# Altium schematic sheet Balancers.SchDoc
size A4; SheetNumber: 2; SheetTotal: 6
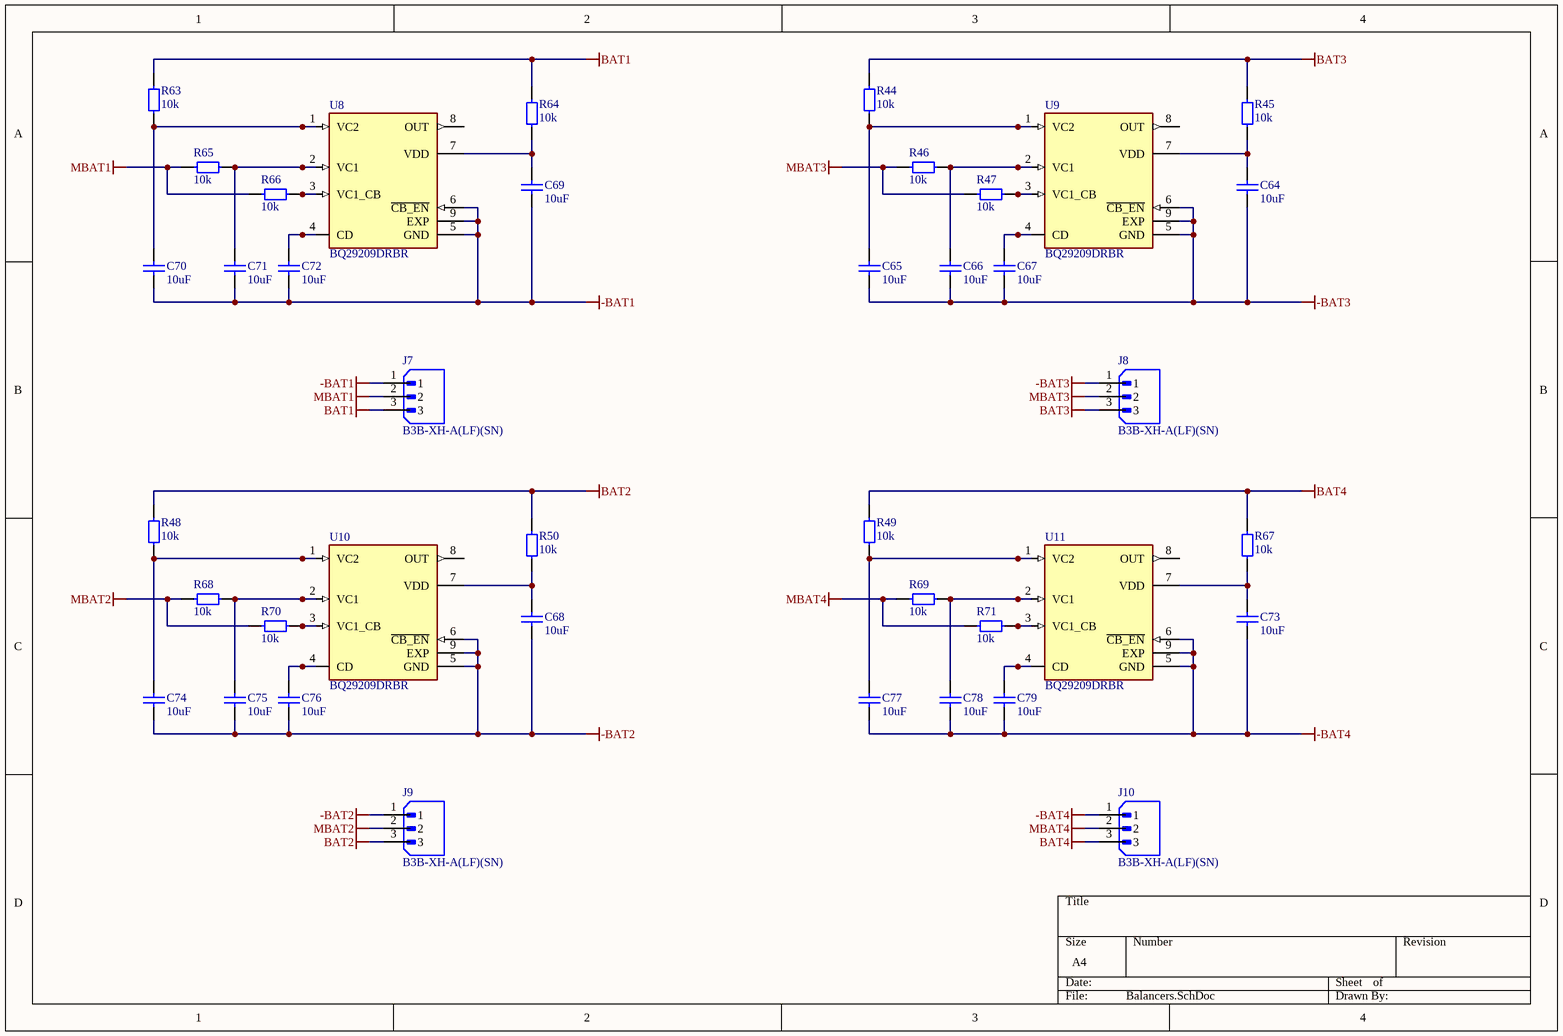
[diagram p0: Balancers.SchDoc]

## Parts
C64  10uF  [0805_CAP]
C65  10uF  [0805_CAP]
C66  10uF  [0805_CAP]
C67  10uF  [0805_CAP]
C68  10uF  [0805_CAP]
C69  10uF  [0805_CAP]
C70  10uF  [0805_CAP]
C71  10uF  [0805_CAP]
C72  10uF  [0805_CAP]
C73  10uF  [0805_CAP]
C74  10uF  [0805_CAP]
C75  10uF  [0805_CAP]
C76  10uF  [0805_CAP]
C77  10uF  [0805_CAP]
C78  10uF  [0805_CAP]
C79  10uF  [0805_CAP]
J7  B3B-XH-A(LF)(SN)  [JST_B3B-XH-A(LF)(SN)]
J8  B3B-XH-A(LF)(SN)  [JST_B3B-XH-A(LF)(SN)]
J9  B3B-XH-A(LF)(SN)  [JST_B3B-XH-A(LF)(SN)]
J10  B3B-XH-A(LF)(SN)  [JST_B3B-XH-A(LF)(SN)]
R44  10k  [0603 Resistor]
R45  10k  [0603 Resistor]
R46  10k  [0603 Resistor]
R47  10k  [0603 Resistor]
R48  10k  [0603 Resistor]
R49  10k  [0603 Resistor]
R50  10k  [0603 Resistor]
R63  10k  [0603 Resistor]
R64  10k  [0603 Resistor]
R65  10k  [0603 Resistor]
R66  10k  [0603 Resistor]
R67  10k  [0603 Resistor]
R68  10k  [0603 Resistor]
R69  10k  [0603 Resistor]
R70  10k  [0603 Resistor]
R71  10k  [0603 Resistor]
U8  BQ29209DRBR  [SON65P300X300X100-9N]
U9  BQ29209DRBR  [SON65P300X300X100-9N]
U10  BQ29209DRBR  [SON65P300X300X100-9N]
U11  BQ29209DRBR  [SON65P300X300X100-9N]

## Nets
-BAT1: C69.1 C70.1 C71.1 C72.1 J7.1 U8.5(GND) U8.6(~{CB_EN}) U8.9(EXP)
-BAT2: C68.1 C74.1 C75.1 C76.1 J9.1 U10.5(GND) U10.6(~{CB_EN}) U10.9(EXP)
-BAT3: C64.1 C65.1 C66.1 C67.1 J8.1 U9.5(GND) U9.6(~{CB_EN}) U9.9(EXP)
-BAT4: C73.1 C77.1 C78.1 C79.1 J10.1 U11.5(GND) U11.6(~{CB_EN}) U11.9(EXP)
BAT1: J7.3 R63.2(CW) R64.2(CW)
BAT2: J9.3 R48.2(CW) R50.2(CW)
BAT3: J8.3 R44.2(CW) R45.2(CW)
BAT4: J10.3 R49.2(CW) R67.2(CW)
MBAT1: J7.2 R65.2(CW) R66.2(CW)
MBAT2: J9.2 R68.2(CW) R70.2(CW)
MBAT3: J8.2 R46.2(CW) R47.2(CW)
MBAT4: J10.2 R69.2(CW) R71.2(CW)
NetC64_2: C64.2 R45.1(CCW) U9.7(VDD)
NetC65_2: C65.2 R44.1(CCW) U9.1(VC2)
NetC66_2: C66.2 R46.1(CCW) U9.2(VC1)
NetC67_2: C67.2 U9.4(CD)
NetC68_2: C68.2 R50.1(CCW) U10.7(VDD)
NetC69_2: C69.2 R64.1(CCW) U8.7(VDD)
NetC70_2: C70.2 R63.1(CCW) U8.1(VC2)
NetC71_2: C71.2 R65.1(CCW) U8.2(VC1)
NetC72_2: C72.2 U8.4(CD)
NetC73_2: C73.2 R67.1(CCW) U11.7(VDD)
NetC74_2: C74.2 R48.1(CCW) U10.1(VC2)
NetC75_2: C75.2 R68.1(CCW) U10.2(VC1)
NetC76_2: C76.2 U10.4(CD)
NetC77_2: C77.2 R49.1(CCW) U11.1(VC2)
NetC78_2: C78.2 R69.1(CCW) U11.2(VC1)
NetC79_2: C79.2 U11.4(CD)
NetR47_1: R47.1(CCW) U9.3(VC1_CB)
NetR66_1: R66.1(CCW) U8.3(VC1_CB)
NetR70_1: R70.1(CCW) U10.3(VC1_CB)
NetR71_1: R71.1(CCW) U11.3(VC1_CB)

Not connected (* = marked no-connect by the designer): U8 8(OUT); U9 8(OUT); U10 8(OUT); U11 8(OUT)

## Library data of the parts
C64-C79 = Capacitor 10uF 0805: 10uF 50V 0805
J7-J10 = B3B-XH-A(LF)(SN): Connector Header Through Hole 3 position 0.098 (2.50mm); MF: JST Sales; SnapEDA_Link: https://www.snapeda.com/parts/B3B-XH-A(LF)(SN)/JST/view-part/?ref=snap; Package: None; Value: *; MP: B3B-XH-A(LF)(SN); Check_prices: https://www.snapeda.com/parts/B3B-XH-A(LF)(SN)/JST/view-part/?ref=eda
R44-R50 R63-R71 = Resistor 10k 0603: 10k 0603
U8-U11 = BQ29209DRBR: Voltage Protection with Automatic Cell Balance For 2-Cell Li-Ion Batteries, OVP=4.30V; MF: Texas Instruments; SnapEDA_Link: https://www.snapeda.com/parts/BQ29209DRBR/Texas+Instruments/view-part/?ref=snap; Package: VSON-8 Texas Instruments; Value: *; MP: BQ29209DRBR; Check_prices: https://www.snapeda.com/parts/BQ29209DRBR/Texas+Instruments/view-part/?ref=eda